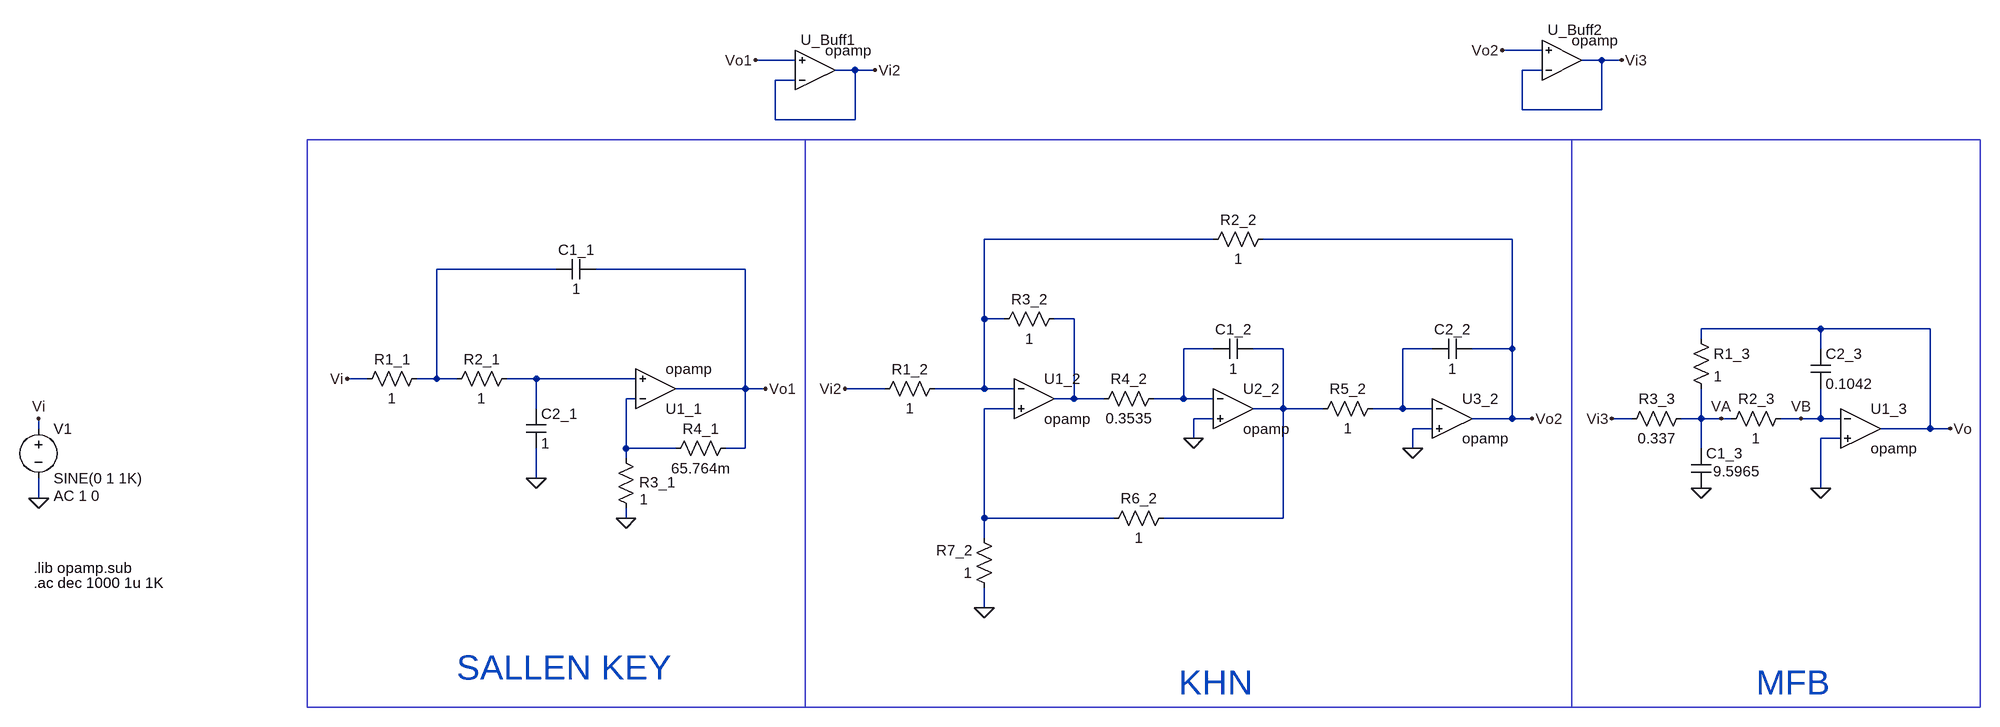
[diagram p0: schematic butterworth_orden6_3etapas.asc]
butterworth_orden6_3etapas.asc, the LTspice schematic file:
Version 4.1
SHEET 1 1092 1188
WIRE 224 -352 160 -352
WIRE -976 -336 -1040 -336
WIRE 320 -336 288 -336
WIRE 352 -336 320 -336
WIRE -880 -320 -912 -320
WIRE -848 -320 -880 -320
WIRE 224 -320 192 -320
WIRE -976 -304 -1008 -304
WIRE 192 -256 192 -320
WIRE 320 -256 320 -336
WIRE 320 -256 192 -256
WIRE -1008 -240 -1008 -304
WIRE -880 -240 -880 -320
WIRE -880 -240 -1008 -240
WIRE -304 -48 -672 -48
WIRE 176 -48 -224 -48
WIRE -1360 0 -1552 0
WIRE -1056 0 -1296 0
WIRE -672 80 -672 -48
WIRE -640 80 -672 80
WIRE -528 80 -560 80
WIRE 672 96 480 96
WIRE 848 96 672 96
WIRE 480 112 480 96
WIRE -304 128 -352 128
WIRE -192 128 -240 128
WIRE 48 128 0 128
WIRE 176 128 176 -48
WIRE 176 128 112 128
WIRE 672 128 672 96
WIRE -1664 176 -1696 176
WIRE -1552 176 -1552 0
WIRE -1552 176 -1584 176
WIRE -1520 176 -1552 176
WIRE -1392 176 -1440 176
WIRE -1232 176 -1392 176
WIRE -1056 192 -1056 0
WIRE -1056 192 -1168 192
WIRE -1024 192 -1056 192
WIRE -832 192 -896 192
WIRE -672 192 -672 80
WIRE -672 192 -752 192
WIRE -624 192 -672 192
WIRE -1232 208 -1248 208
WIRE -528 208 -528 80
WIRE -528 208 -560 208
WIRE -480 208 -528 208
WIRE -352 208 -352 128
WIRE -352 208 -400 208
WIRE -304 208 -352 208
WIRE -1392 224 -1392 176
WIRE -624 224 -672 224
WIRE -192 224 -192 128
WIRE -192 224 -240 224
WIRE -128 224 -192 224
WIRE 0 224 0 128
WIRE 0 224 -48 224
WIRE 48 224 0 224
WIRE -304 240 -336 240
WIRE 176 240 176 128
WIRE 176 240 112 240
WIRE 208 240 176 240
WIRE 368 240 336 240
WIRE 480 240 480 192
WIRE 480 240 448 240
WIRE 512 240 480 240
WIRE 528 240 512 240
WIRE 640 240 608 240
WIRE 672 240 672 192
WIRE 672 240 640 240
WIRE 704 240 672 240
WIRE -2192 256 -2192 240
WIRE 48 256 16 256
WIRE 848 256 848 96
WIRE 848 256 768 256
WIRE 880 256 848 256
WIRE -336 272 -336 240
WIRE 704 272 672 272
WIRE -1248 288 -1248 208
WIRE -1168 288 -1248 288
WIRE -1056 288 -1056 192
WIRE -1056 288 -1088 288
WIRE 16 288 16 256
WIRE 480 288 480 240
WIRE -1248 304 -1248 288
WIRE -1392 336 -1392 288
WIRE 672 352 672 272
WIRE -2192 368 -2192 336
WIRE -1248 400 -1248 384
WIRE -672 400 -672 224
WIRE -464 400 -672 400
WIRE -192 400 -192 224
WIRE -192 400 -384 400
WIRE -672 432 -672 400
WIRE -672 544 -672 512
FLAG -672 544 0
FLAG -336 272 0
FLAG 16 288 0
FLAG -896 192 Vi2
FLAG 208 240 Vo2
FLAG -2192 368 0
FLAG -2192 240 Vi
FLAG -1392 336 0
FLAG -1248 400 0
FLAG -1024 192 Vo1
FLAG -1696 176 Vi
FLAG 672 352 0
FLAG 336 240 Vi3
FLAG 880 256 Vo
FLAG 480 352 0
FLAG 512 240 VA
FLAG 640 240 VB
FLAG -1040 -336 Vo1
FLAG -848 -320 Vi2
FLAG 160 -352 Vo2
FLAG 352 -336 Vi3
SYMBOL res -736 176 R90
WINDOW 0 0 56 VBottom 2
WINDOW 3 32 56 VTop 2
SYMATTR InstName R1_2
SYMATTR Value 1
SYMBOL res -208 -64 R90
WINDOW 0 0 56 VBottom 2
WINDOW 3 32 56 VTop 2
SYMATTR InstName R2_2
SYMATTR Value 1
SYMBOL OpAmps\\opamp -592 144 R0
SYMATTR InstName U1_2
SYMBOL OpAmps\\opamp -272 160 R0
SYMATTR InstName U2_2
SYMBOL OpAmps\\opamp 80 176 R0
SYMATTR InstName U3_2
SYMBOL res -544 64 R90
WINDOW 0 0 56 VBottom 2
WINDOW 3 32 56 VTop 2
SYMATTR InstName R3_2
SYMATTR Value 1
SYMBOL res -384 192 R90
WINDOW 0 0 56 VBottom 2
WINDOW 3 32 56 VTop 2
SYMATTR InstName R4_2
SYMATTR Value 0.3535
SYMBOL res -32 208 R90
WINDOW 0 0 56 VBottom 2
WINDOW 3 32 56 VTop 2
SYMATTR InstName R5_2
SYMATTR Value 1
SYMBOL res -368 384 R90
WINDOW 0 0 56 VBottom 2
WINDOW 3 32 56 VTop 2
SYMATTR InstName R6_2
SYMATTR Value 1
SYMBOL res -656 528 R180
WINDOW 0 36 76 Left 2
WINDOW 3 36 40 Left 2
SYMATTR InstName R7_2
SYMATTR Value 1
SYMBOL cap -240 112 R90
WINDOW 0 0 32 VBottom 2
WINDOW 3 32 32 VTop 2
SYMATTR InstName C1_2
SYMATTR Value 1
SYMBOL cap 112 112 R90
WINDOW 0 0 32 VBottom 2
WINDOW 3 32 32 VTop 2
SYMATTR InstName C2_2
SYMATTR Value 1
SYMBOL voltage -2192 240 R0
WINDOW 123 24 124 Left 2
WINDOW 39 0 0 Left 0
SYMATTR Value2 AC 1 0
SYMATTR InstName V1
SYMATTR Value SINE(0 1 1K)
SYMBOL res -1568 160 R90
WINDOW 0 0 56 VBottom 2
WINDOW 3 32 56 VTop 2
SYMATTR InstName R1_1
SYMATTR Value 1
SYMBOL res -1424 160 R90
WINDOW 0 0 56 VBottom 2
WINDOW 3 32 56 VTop 2
SYMATTR InstName R2_1
SYMATTR Value 1
SYMBOL cap -1408 224 R0
SYMATTR InstName C2_1
SYMATTR Value 1
SYMBOL cap -1296 -16 R90
WINDOW 0 0 32 VBottom 2
WINDOW 3 32 32 VTop 2
SYMATTR InstName C1_1
SYMATTR Value 1
SYMBOL res -1264 288 R0
WINDOW 0 37 54 Left 2
WINDOW 3 38 82 Left 2
SYMATTR InstName R3_1
SYMATTR Value 1
SYMBOL res -1072 272 R90
WINDOW 0 0 56 VBottom 2
WINDOW 3 32 56 VTop 2
SYMATTR InstName R4_1
SYMATTR Value 65.764m
SYMBOL OpAmps\\opamp -1200 256 M180
SYMATTR InstName U1_1
SYMBOL OpAmps\\opamp 736 192 R0
SYMATTR InstName U1_3
SYMBOL res 624 224 R90
WINDOW 0 0 56 VBottom 2
WINDOW 3 32 56 VTop 2
SYMATTR InstName R2_3
SYMATTR Value 1
SYMBOL cap 464 288 R0
WINDOW 3 35 37 Left 2
SYMATTR Value 9.5965
SYMATTR InstName C1_3
SYMBOL res 464 96 R0
SYMATTR InstName R1_3
SYMATTR Value 1
SYMBOL res 464 224 R90
WINDOW 0 0 56 VBottom 2
WINDOW 3 32 56 VTop 2
SYMATTR InstName R3_3
SYMATTR Value 0.337
SYMBOL cap 656 128 R0
SYMATTR InstName C2_3
SYMATTR Value 0.1042
SYMBOL OpAmps\\opamp -944 -256 M180
WINDOW 0 -23 113 Left 2
SYMATTR InstName U_Buff1
SYMBOL OpAmps\\opamp 256 -272 M180
WINDOW 0 -23 113 Left 2
SYMATTR InstName U_Buff2
TEXT -2200 480 Left 2 !.lib opamp.sub
TEXT -2200 504 Left 2 !.ac dec 1000 1u 1K
TEXT -1520 640 Left 5 ;SALLEN KEY
TEXT -360 664 Left 5 ;KHN
TEXT 568 664 Left 5 ;MFB
RECTANGLE Normal 928 704 272 -208
RECTANGLE Normal -960 704 272 -208
RECTANGLE Normal -1760 704 -960 -208

The netlist it stands for:
* butterworth_orden6_3etapas.asc
R1_2 N001 Vi2 1
R2_2 Vo2 N001 1
X§U1_2 N001 N009 N003 opamp Aol=100K GBW=10Meg  ; pins invin noninvin out
X§U2_2 N004 0 N005 opamp Aol=100K GBW=10Meg  ; pins invin noninvin out
X§U3_2 N006 0 Vo2 opamp Aol=100K GBW=10Meg  ; pins invin noninvin out
R3_2 N003 N001 1
R4_2 N004 N003 0.3535
R5_2 N006 N005 1
R6_2 N005 N009 1
R7_2 0 N009 1
C1_2 N005 N004 1
C2_2 Vo2 N006 1
V1 Vi 0 SINE(0 1 1K) AC 1 0
R1_1 N002 Vi 1
R2_1 N007 N002 1
C2_1 N007 0 1
C1_1 Vo1 N002 1
R3_1 N008 0 1
R4_1 Vo1 N008 65.764m
X§U1_1 N008 N007 Vo1 opamp Aol=100K GBW=10Meg  ; pins invin noninvin out
X§U1_3 VB 0 Vo opamp Aol=100K GBW=10Meg  ; pins invin noninvin out
R2_3 VB VA 1
C1_3 VA 0 9.5965
R1_3 Vo VA 1
R3_3 VA Vi3 0.337
C2_3 Vo VB 0.1042
X§U_Buff1 Vi2 Vo1 Vi2 opamp Aol=100K GBW=10Meg  ; pins invin noninvin out
X§U_Buff2 Vi3 Vo2 Vi3 opamp Aol=100K GBW=10Meg  ; pins invin noninvin out
.lib opamp.sub
.ac dec 1000 1u 1K
* SALLEN KEY
* KHN
* MFB
.backanno
.end